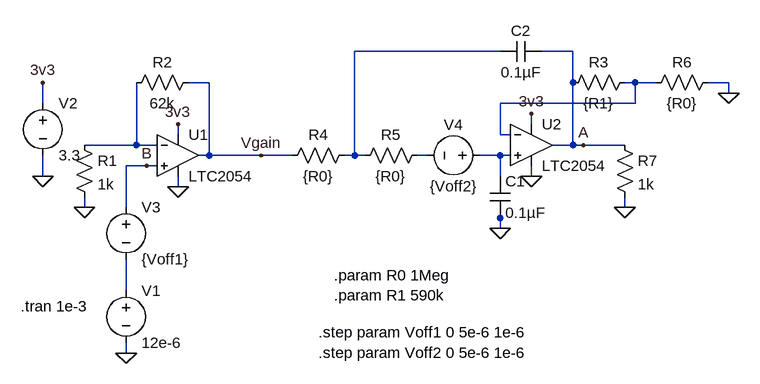
[diagram p0: schematic CMP3_Amp.asc]
CMP3_Amp.asc, the LTspice schematic file:
Version 4
SHEET 1 1656 680
WIRE 592 -32 368 -32
WIRE 704 -32 656 -32
WIRE 144 16 112 16
WIRE 704 16 704 -32
WIRE 800 16 784 16
WIRE 832 16 800 16
WIRE 944 16 912 16
WIRE 944 32 944 16
WIRE -112 48 -112 16
WIRE 800 48 800 16
WIRE 800 48 592 48
WIRE 640 80 640 64
WIRE 96 96 96 80
WIRE 592 96 592 48
WIRE 608 96 592 96
WIRE 32 112 32 16
WIRE 32 112 -48 112
WIRE 64 112 32 112
WIRE 704 112 704 16
WIRE 704 112 672 112
WIRE 720 112 704 112
WIRE 784 112 720 112
WIRE 144 128 144 16
WIRE 144 128 128 128
WIRE 224 128 144 128
WIRE 272 128 224 128
WIRE 368 128 368 -32
WIRE 368 128 352 128
WIRE 384 128 368 128
WIRE 480 128 464 128
WIRE 592 128 560 128
WIRE 608 128 592 128
WIRE 48 144 16 144
WIRE 64 144 48 144
WIRE -112 160 -112 128
WIRE 592 160 592 128
WIRE 640 160 640 144
WIRE 96 176 96 160
WIRE -48 208 -48 192
WIRE 16 208 16 144
WIRE 784 208 784 192
WIRE 592 224 592 208
WIRE 592 240 592 224
WIRE 16 336 16 288
WIRE 16 432 16 416
FLAG 96 176 0
FLAG -112 160 0
FLAG -112 16 3v3
FLAG 96 80 3v3
FLAG -48 208 0
FLAG 16 432 0
FLAG 640 160 0
FLAG 640 64 3v3
FLAG 592 240 0
FLAG 944 32 0
FLAG 784 208 0
FLAG 224 128 Vgain
FLAG 48 144 B
FLAG 720 112 A
SYMBOL Opamps\\LTC2054 96 128 R0
SYMATTR InstName U1
SYMBOL voltage 16 320 R0
WINDOW 123 24 124 Left 2
WINDOW 39 0 0 Left 2
SYMATTR InstName V1
SYMATTR Value 12e-6
SYMBOL res -64 96 R0
SYMATTR InstName R1
SYMATTR Value 1k
SYMBOL res 128 0 R90
WINDOW 0 0 56 VBottom 2
WINDOW 3 32 56 VTop 2
SYMATTR InstName R2
SYMATTR Value 62k
SYMBOL voltage -112 32 R0
WINDOW 123 0 0 Left 2
WINDOW 39 0 0 Left 2
SYMATTR InstName V2
SYMATTR Value 3.3
SYMBOL Opamps\\LTC2054 640 112 R0
SYMATTR InstName U2
SYMBOL res 368 112 R90
WINDOW 0 0 56 VBottom 2
WINDOW 3 32 56 VTop 2
SYMATTR InstName R4
SYMATTR Value {R0}
SYMBOL res 480 112 R90
WINDOW 0 0 56 VBottom 2
WINDOW 3 32 56 VTop 2
SYMATTR InstName R5
SYMATTR Value {R0}
SYMBOL cap 576 160 R0
SYMATTR InstName C1
SYMATTR Value 0.1µF
SYMBOL res 800 0 R90
WINDOW 0 0 56 VBottom 2
WINDOW 3 32 56 VTop 2
SYMATTR InstName R3
SYMATTR Value {R1}
SYMBOL res 816 32 R270
WINDOW 0 32 56 VTop 2
WINDOW 3 0 56 VBottom 2
SYMATTR InstName R6
SYMATTR Value {R0}
SYMBOL cap 656 -48 R90
WINDOW 0 0 32 VBottom 2
WINDOW 3 32 32 VTop 2
SYMATTR InstName C2
SYMATTR Value 0.1µF
SYMBOL res 768 96 R0
SYMATTR InstName R7
SYMATTR Value 1k
SYMBOL voltage 16 192 R0
SYMATTR InstName V3
SYMATTR Value {Voff1}
SYMBOL voltage 576 128 R90
WINDOW 0 -32 56 VBottom 2
WINDOW 3 32 56 VTop 2
SYMATTR InstName V4
SYMATTR Value {Voff2}
TEXT 336 312 Left 2 !.param R0 1Meg\n.param R1 590k
TEXT -146 360 Left 2 !.tran 1e-3
TEXT 312 400 Left 2 !.step param Voff1 0 5e-6 1e-6\n.step param Voff2 0 5e-6 1e-6

The netlist it stands for:
* CMP3_Amp.asc
XU1 B N003 Vgain 3v3 0 LTC2054  ; pins In+ In- OUT V+ V-
V1 N006 0 12e-6
R1 N003 0 1k
R2 Vgain N003 62k
V2 3v3 0 3.3
XU2 N005 N002 A 3v3 0 LTC2054  ; pins In+ In- OUT V+ V-
R4 N001 Vgain {R0}
R5 N004 N001 {R0}
C1 N005 0 0.1µF
R3 N002 A {R1}
R6 N002 0 {R0}
C2 A N001 0.1µF
R7 A 0 1k
V3 B N006 {Voff1}
V4 N005 N004 {Voff2}
.param R0 1Meg
.param R1 590k
.tran 1e-3
.step param Voff1 0 5e-6 1e-6
.step param Voff2 0 5e-6 1e-6
.lib LTC2.lib
.backanno
.end